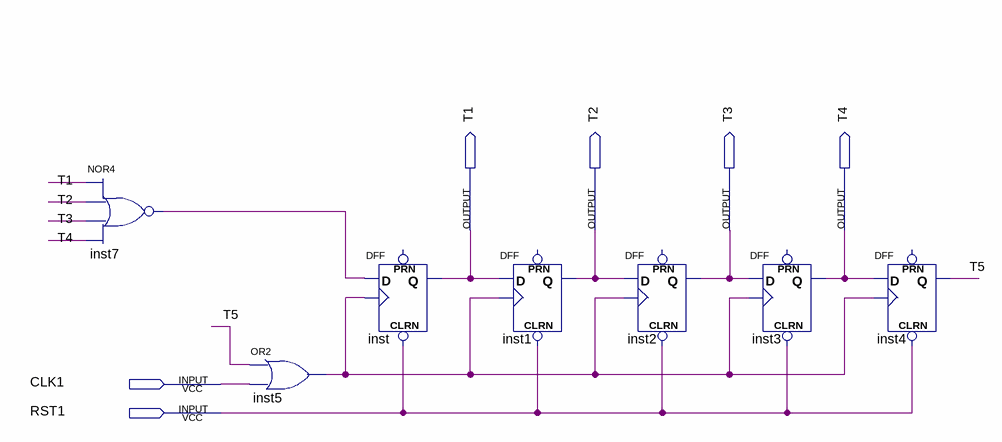
[diagram p0: schematic sheet]
// Quartus schematic sequence-generator.bdf as structural Verilog: 7 symbols, 6 pins
module \sequence-generator  (
  input  CLK1,
  input  RST1,
  output T1,
  output T2,
  output T3,
  output T4
);

  wire inst5_out, inst7_out, T5;

  nor inst7 (inst7_out, T1, T2, T3, T4);
  or inst5 (inst5_out, T5, CLK1);
  DFF inst (.CLRN(RST1), .CLK(inst5_out), .D(inst7_out), .Q(T1));  // open: PRN
  DFF inst1 (.CLRN(RST1), .CLK(inst5_out), .D(T1), .Q(T2));  // open: PRN
  DFF inst2 (.CLRN(RST1), .CLK(inst5_out), .D(T2), .Q(T3));  // open: PRN
  DFF inst3 (.CLRN(RST1), .CLK(inst5_out), .D(T3), .Q(T4));  // open: PRN
  DFF inst4 (.CLRN(RST1), .CLK(inst5_out), .D(T4), .Q(T5));  // open: PRN
endmodule
